# Altium schematic sheet CW308T_ADUCM3029.SchDoc: ADUCM3029 for CW308T
size Letter; Organization: NewAE Technology Inc.; Address1: 1083 Queen St., Suite 196; Address2: Halifax; Address3: NS; Address4: Canada B3H 0B2; SheetApproved: NO
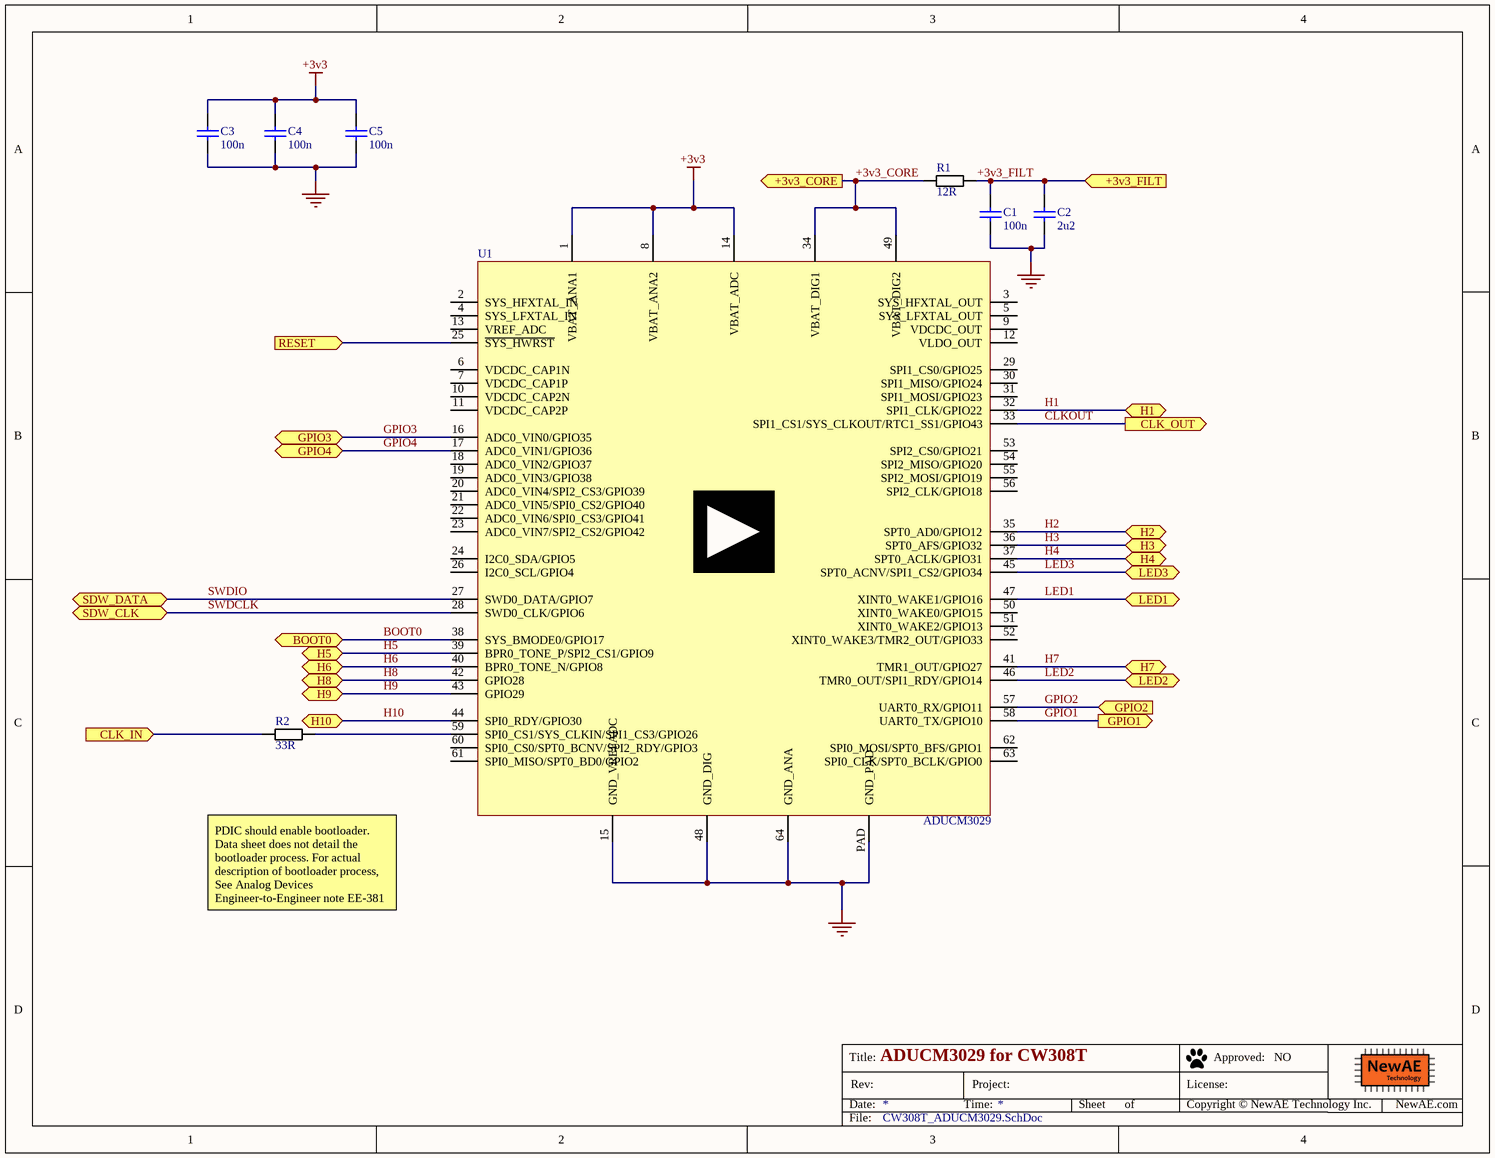
[diagram p0: CW308T_ADUCM3029.SchDoc]

## Parts
C1  100n  [CAPC0603_M]
C2  2u2  [CAPC0603_M]
C3  100n  [CAPC0603_M]
C4  100n  [CAPC0603_M]
C5  100n  [CAPC0603_M]
R1  12R  [RESC1608X55N]
R2  33R  [RESC1608X55N]
U1  ADUCM3029  [LFCSP-64]

## Ports
+3v3_CORE (out), +3v3_FILT (in), BOOT0 (bidir), CLK_IN (in), CLK_OUT (out), GPIO1 (out), GPIO2 (in), GPIO3 (bidir), GPIO4 (bidir), H1 (bidir), H2 (bidir), H3 (bidir), H4 (bidir), H5 (bidir), H6 (bidir), H7 (bidir), H8 (bidir), H9 (bidir), H10 (bidir), LED1 (bidir), LED2 (bidir), LED3 (bidir), RESET (in), SDW_CLK (bidir), SDW_DATA (bidir)

## Nets
+3v3: C3.1 C4.1 C5.1 U1.1(VBAT_ANA1) U1.8(VBAT_ANA2) U1.14(VBAT_ADC)
GND: C1.2 C2.2 C3.2 C4.2 C5.2 U1.15(GND_VREFADC) U1.48(GND_DIG) U1.64(GND_ANA) U1.PAD(GND_PAD)
+3v3_CORE: R1.1 U1.34(VBAT_DIG1) U1.49(VBAT_DIG2) ; port +3v3_CORE
+3v3_FILT: C1.1 C2.1 R1.2 ; port +3v3_FILT
BOOT0: U1.38(SYS_BMODE0/GPIO17) ; port BOOT0
CLK_IN: R2.1 ; port CLK_IN
CLKOUT: U1.33(SPI1_CS1/SYS_CLKOUT/RTC1_SS1/GPIO43) ; port CLK_OUT
GPIO1: U1.58(UART0_TX/GPIO10) ; port GPIO1
GPIO2: U1.57(UART0_RX/GPIO11) ; port GPIO2
GPIO3: U1.16(ADC0_VIN0/GPIO35) ; port GPIO3
GPIO4: U1.17(ADC0_VIN1/GPIO36) ; port GPIO4
H1: U1.32(SPI1_CLK/GPIO22) ; port H1
H2: U1.35(SPT0_AD0/GPIO12) ; port H2
H3: U1.36(SPT0_AFS/GPIO32) ; port H3
H4: U1.37(SPT0_ACLK/GPIO31) ; port H4
H5: U1.39(BPR0_TONE_P/SPI2_CS1/GPIO9) ; port H5
H6: U1.40(BPR0_TONE_N/GPIO8) ; port H6
H7: U1.41(TMR1_OUT/GPIO27) ; port H7
H8: U1.42(GPIO28) ; port H8
H9: U1.43(GPIO29) ; port H9
H10: U1.44(SPI0_RDY/GPIO30) ; port H10
LED1: U1.47(XINT0_WAKE1/GPIO16) ; port LED1
LED2: U1.46(TMR0_OUT/SPI1_RDY/GPIO14) ; port LED2
LED3: U1.45(SPT0_ACNV/SPI1_CS2/GPIO34) ; port LED3
RESET: U1.25(~{SYS_HWRST}) ; port RESET
SWDCLK: U1.28(SWD0_CLK/GPIO6) ; port SDW_CLK
SWDIO: U1.27(SWD0_DATA/GPIO7) ; port SDW_DATA
NetR2_2: R2.2 U1.59(SPI0_CS1/SYS_CLKIN/SPI1_CS3/GPIO26)

Not connected (* = marked no-connect by the designer): U1 2(SYS_HFXTAL_IN) 3(SYS_HFXTAL_OUT) 4(SYS_LFXTAL_IN) 5(SYS_LFXTAL_OUT) 6(VDCDC_CAP1N) 7(VDCDC_CAP1P) 9(VDCDC_OUT) 10(VDCDC_CAP2N) 11(VDCDC_CAP2P) 12(VLDO_OUT) 13(VREF_ADC) 18(ADC0_VIN2/GPIO37) 19(ADC0_VIN3/GPIO38) 20(ADC0_VIN4/SPI2_CS3/GPIO39) 21(ADC0_VIN5/SPI0_CS2/GPIO40) 22(ADC0_VIN6/SPI0_CS3/GPIO41) 23(ADC0_VIN7/SPI2_CS2/GPIO42) 24(I2C0_SDA/GPIO5) 26(I2C0_SCL/GPIO4) 29(SPI1_CS0/GPIO25) 30(SPI1_MISO/GPIO24) 31(SPI1_MOSI/GPIO23) 50(XINT0_WAKE0/GPIO15) 51(XINT0_WAKE2/GPIO13) 52(XINT0_WAKE3/TMR2_OUT/GPIO33) 53(SPI2_CS0/GPIO21) 54(SPI2_MISO/GPIO20) 55(SPI2_MOSI/GPIO19) 56(SPI2_CLK/GPIO18) 60(SPI0_CS0/SPT0_BCNV/SPI2_RDY/GPIO3) 61(SPI0_MISO/SPT0_BD0/GPIO2) 62(SPI0_MOSI/SPT0_BFS/GPIO1) 63(SPI0_CLK/SPT0_BCLK/GPIO0)

## Notes on the sheet
- PDIC should enable bootloader. Data sheet does not detail the bootloader process. For actual description of bootloader process, See Analog Devices Engineer-to-Engineer note EE-381
- Title:
- Date:
- Rev:
- Time:
- Project:
- Sheet
- of
- License:
- Copyright © NewAE Technology Inc.
- Approved:
- NewAE.com
- File:

## Library data of the parts
C1 C3-C5 = CCHIP-100n-0603: 100n, 0603; Manufacture 1: Kemet; Manufacture Part Number 1: C0603C104K5RACTU; Component Group: Capacitor; Case-EIA: 0603; Case-Metric: 1608; Rated Voltage: 50VDC; Part Number: CCHIP-100n-0603; Footprint: 0603; Pin Count: 2; Supplier 1: Digi-Key; Supplier Part Number 1: 399-5089-2-ND; Value: 100n; Mounting Technology: SMT; Component Kind: Standard; Component Type: Standard
C2 = CCHIP-2u2-0603: 2u2, 0603; Manufacture 1: Samsung; Manufacture Part Number 1: CL10B225KP8NNNC; Component Group: Capacitor; Case-EIA: 0603; Case-Metric: 1608; Rated Voltage: 10VDC; Part Number: CCHIP-2u2-0603; Footprint: 0603; Pin Count: 2; Supplier 1: Digi-Key; Supplier Part Number 1: 1276-1134-2-ND; Value: 2u2; Mounting Technology: SMT; Component Kind: Standard; Component Type: Standard
R1 = RCHIP-12R-0603: 12R res, 0603, 1%, 1/10W; Manufacture 1: Yageo; Manufacture Part Number 1: RC0603FR-0712RL; Component Group: Resistor; Case-EIA: 0603; Case-Metric: 1608; Rated Power: 0.1W; Rated Voltage: 75VDC; Part Number: RCHIP-12R-0603; Footprint: 0603; Pin Count: 2; Supplier 1: Digi-Key; Supplier Part Number 1: 311-12.0HRCT-ND; Value: 12R; Tolerance: 1%; Mounting Technology: SMT; Temperature Range: -55C to 155C; Component Kind: Standard; Component Type: Standard
R2 = RCHIP-33R-0603: 33R res, 0603, 1%, 1/10W; Manufacture 1: Yageo; Manufacture Part Number 1: RC0603FR-0733RL; Component Group: Resistor; Case-EIA: 0603; Case-Metric: 1608; Rated Power: 0.1W; Rated Voltage: 75VDC; Part Number: RCHIP-33R-0603; Footprint: 0603; Pin Count: 2; Supplier 1: Digi-Key; Supplier Part Number 1: 311-33.0HRCT-ND; Value: 33R; Tolerance: 1%; Mounting Technology: SMT; Temperature Range: -55C to 155C; Component Kind: Standard; Component Type: Standard
U1 = ADUCM3029BCPZ: IC MCU 32BIT 256KB FLASH 64LFCSP; Manufacture 1: Analog Devices Inc.; Component Group: Digital IC; PP Material Stack: 0; Part Number: ADUCM3029BCPZ; Manufacture Part Number 1: ADUCM3029BCPZ; Pin Count: 64; Supplier 1: Digi-Key; Supplier Part Number 1: ADUCM3029BCPZ-ND; Mounting Technology: SMT; RoHS: Yes; Component Kind: Standard; Component Type: Standard; PP Rotation: 0